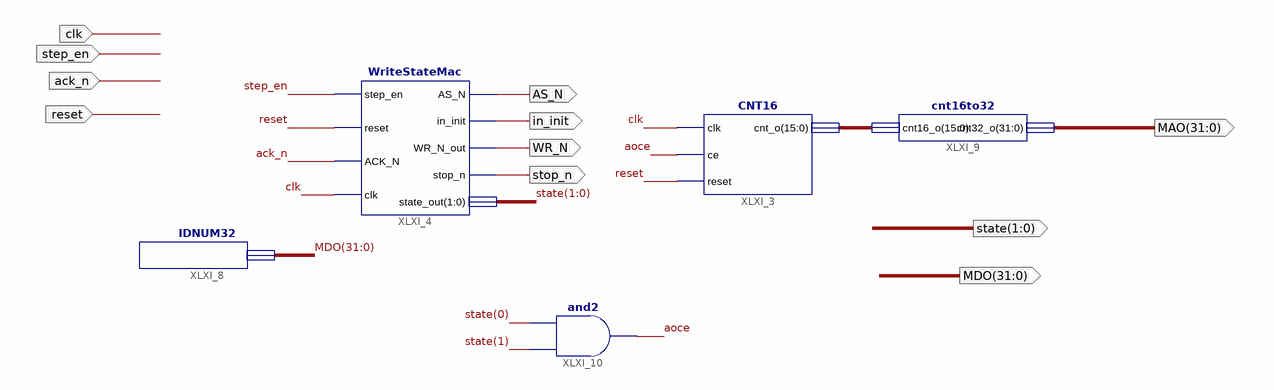
[diagram p0: schematic sheet 1]
// Xilinx ISE schematic WriteMachine.sch (spartan6) as structural Verilog: 5 symbols, 11 ports
module WriteMachine (
  input  clk,
  input  step_en,
  input  ack_n,
  input  reset,
  output AS_N,
  output in_init,
  output WR_N,
  output stop_n,
  output [31:0] MDO,
  output [31:0] MAO,
  output [1:0] state
);

  wire aoce;
  wire [15:0] XLXN_33;

  WriteStateMac XLXI_4 (
    .step_en(step_en), .reset(reset), .ACK_N(ack_n), .clk(clk), .AS_N(AS_N), .in_init(in_init),
    .WR_N_out(WR_N), .stop_n(stop_n), .state_out(state));
  CNT16 XLXI_3 (.clk(clk), .ce(aoce), .reset(reset), .cnt_o(XLXN_33));
  IDNUM32 XLXI_8 (.ID(MDO));
  cnt16to32 XLXI_9 (.cnt16_o(XLXN_33), .cnt32_o(MAO));
  and XLXI_10 (aoce, state[1], state[0]);
endmodule
